# EAGLE schematic gatedriver_ixys (EAGLE 7.2.0)
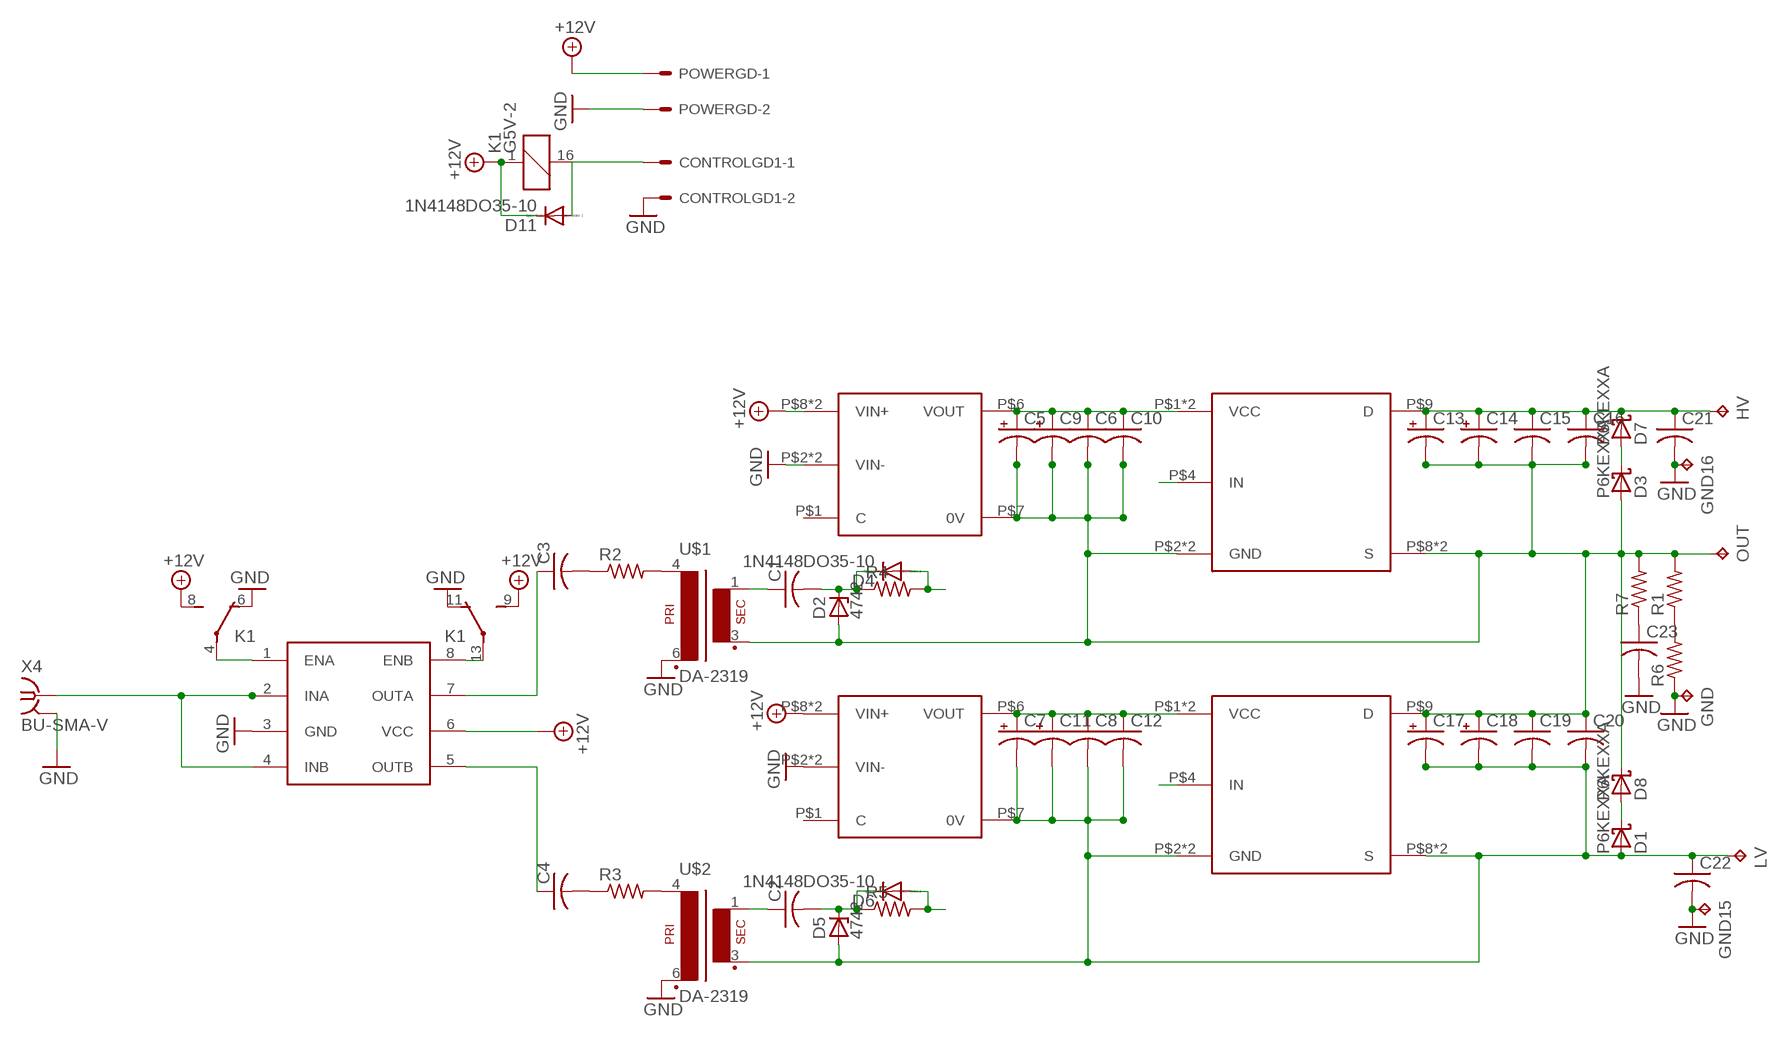
[diagram p0: schematic, sheet 1]

## Parts
C1  C-US050-055X075  [C050-055X075]
C2  C-US050-055X075  [C050-055X075]
C3  C-US050-055X075  [C050-055X075]
C4  C-US050-055X075  [C050-055X075]
C5  CPOL-USE5-10.5  [E5-10,5]
C6  C-US050-075X075  [C050-075X075]
C7  CPOL-USE5-10.5  [E5-10,5]
C8  C-US050-075X075  [C050-075X075]
C9  CPOL-USE5-10.5  [E5-10,5]
C10  C-US050-075X075  [C050-075X075]
C11  CPOL-USE5-10.5  [E5-10,5]
C12  C-US050-075X075  [C050-075X075]
C13  CPOL-USE5-10.5  [E5-10,5]
C14  CPOL-USE5-10.5  [E5-10,5]
C15  C-US050-075X075  [C050-075X075]
C16  C-US050-075X075  [C050-075X075]
C17  CPOL-USE5-10.5  [E5-10,5]
C18  CPOL-USE5-10.5  [E5-10,5]
C19  C-US050-075X075  [C050-075X075]
C20  C-US050-075X075  [C050-075X075]
C21  C-US102-064X133  [C102-064X133]
C22  C-US102-064X133  [C102-064X133]
C23  C-US102-064X133  [C102-064X133]
CONTROLGD1  KK-156-2  [KK-156-2]
D1  P6KEXXA  [C1702-15]
D2  4742  ZENER-DIODEZD-10  [ZDIO-10]
D3  P6KEXXA  [C1702-15]
D4  1N4148DO35-10  [DO35-10]
D5  4742  ZENER-DIODEZD-10  [ZDIO-10]
D6  1N4148DO35-10  [DO35-10]
D7  P6KEXXA  [C1702-15]
D8  P6KEXXA  [C1702-15]
D11  1N4148DO35-10  [DO35-10]
DC1  NCS  [NCS]
DC2  NCS  [NCS]
GND  TPPAD1-20Y  [P1-20Y]
GND15  TPPAD1-20Y  [P1-20Y]
GND16  TPPAD1-20Y  [P1-20Y]
HV  TPPAD1-20Y  [P1-20Y]
K1  G5V-2  [G5V-2]
LV  TPPAD1-20Y  [P1-20Y]
OUT  TPPAD1-20Y  [P1-20Y]
POWERGD  KK-156-2  [KK-156-2]
R1  R-US_0414/15  [0414/15]
R2  R-US_0207/15  [0207/15]
R3  R-US_0207/12  [0207/12]
R4  R-US_0207/10  [0207/10]
R5  R-US_0207/10  [0207/10]
R6  R-US_0414/15  [0414/15]
R7  R-US_0414/15  [0414/15]
U$1  DA-2319  [DIL06]
U$2  DA-2319  [DIL06]
U$3  UCC27425  [DIL08]
U$8  IXZ631DF12N100  [IXZ631DF12N100]
U$9  IXZ631DF12N100  [IXZ631DF12N100]
X4  BU-SMA-V  [BU-SMA-V]

## Nets
+12V: D11.C DC1.P$8(VIN+) DC1.P$9(VIN+) DC2.P$8(VIN+) DC2.P$9(VIN+) K1.1 K1.8(1:S) K1.9(2:S) POWERGD.1 U$3.6(VCC)
ENSW: CONTROLGD1.1 D11.A K1.16
GD_HI: D4.A R4.2 U$8.P$4(IN)
GD_LO: D6.A R5.2 U$9.P$4(IN)
GND: C21.2 C22.2 C23.2 CONTROLGD1.2 DC1.P$2(VIN-) DC1.P$3(VIN-) DC2.P$2(VIN-) DC2.P$3(VIN-) GND15.TP GND16.TP GND.TP K1.6(1:O) K1.11(2:O) POWERGD.2 R6.1 U$1.6(P2) U$2.6(P2) U$3.3(GND) X4.2 X4.3 X4.4 X4.5
N$1: U$3.2(INA) U$3.4(INB) X4.1
N$2: C3.1 U$3.7(OUTA)
N$3: R2.2 U$1.4(P1)
N$4: C4.1 U$3.5(OUTB)
N$5: R3.2 U$2.4(P1)
N$6: C4.2 R3.1
N$7: C5.+ C6.1 C9.+ C10.1 DC1.P$6(VOUT) U$8.P$1(VCC) U$8.P$7(VCC)
N$8: C7.+ C8.1 C11.+ C12.1 DC2.P$6(VOUT) U$9.P$1(VCC) U$9.P$7(VCC)
N$9: D3.C D7.A
N$10: C1.1 U$1.1(S4)
N$11: C2.1 U$2.1(S4)
N$12: R1.1 R6.2
N$13: C23.1 R7.1
N$14: K1.4(1:P) U$3.1(ENA)
N$15: K1.13(2:P) U$3.8(ENB)
N$16: C3.2 R2.1
N$17: C13.+ C14.+ C15.1 C16.1 C21.1 D7.C HV.TP U$8.P$9(D)
N$18: D1.C D8.A
N$19: C7.- C8.2 C11.- C12.2 C17.- C18.- C19.2 C20.2 C22.1 D1.A D5.A DC2.P$7(0V) LV.TP U$2.3(S3) U$9.P$2(GND) U$9.P$6(GND) U$9.P$8(S) U$9.P$10(S)
N$20: C1.2 D2.C D4.C R4.1
N$21: C2.2 D5.C D6.C R5.1
OUT: C5.- C6.2 C9.- C10.2 C13.- C14.- C15.2 C16.2 C17.+ C18.+ C19.1 C20.1 D2.A D3.A D8.C DC1.P$7(0V) OUT.TP R1.2 R7.2 U$1.3(S3) U$8.P$2(GND) U$8.P$6(GND) U$8.P$8(S) U$8.P$10(S) U$9.P$9(D)
Unconnected: DC1.P$1(C) DC2.P$1(C)

## Library data of the parts
C1-C4 C6 C8 C10 C12 C15 C16 C19 C20 = resistor:C-US: CAPACITOR, American symbol
C5 C7 C9 C11 C13 C14 C17 C18 = rcl:CPOL-US: POLARIZED CAPACITOR, American symbol
C21-C23 = rcl:C-US: CAPACITOR, American symbol
CONTROLGD1 POWERGD = con-molex:KK-156-2: KK 156 HEADER Source: http://www.molex.com/pdm_docs/sd/026604100_sd.pdf; OC_FARNELL: unknown; OC_NEWARK: unknown
D1 D3 D7 D8 = diode:P6KEXXA: DIODE transient-voltage suppressor
D2 D5 = diode:ZENER-DIODE: Z-Diode
D4 D6 D11 = diode:1N4148: DIODE high speed (Philips)
DC1 DC2 = dc-dc-converter:NCS: DC-DC CONVERTER
GND GND15 GND16 HV LV OUT = testpad:TP: Test pad
K1 = relay:G5V-2: OMRON PCB Relay Source: http://www.omron.com/ecb/products/pdf/en-g5v2.pdf; MPN: G5V-2 5DC; OC_FARNELL: 9949488; OC_NEWARK: 78K5703
R1-R7 = resistor:R-US_: RESISTOR, American symbol
U$1 U$2 = trafo:DA-2319
U$3 = texas:UCC27425
U$8 U$9 = hvsw:IXZ631DF12N100
X4 = con-coax:BU-SMA-V: FEMALE SMA CONNECTOR Radiall distributor RS 112-3794; OC_FARNELL: unknown; OC_NEWARK: unknown